# Altium schematic sheet Sheet1.SchDoc
size A; SheetNumber: 1; SheetTotal: 1
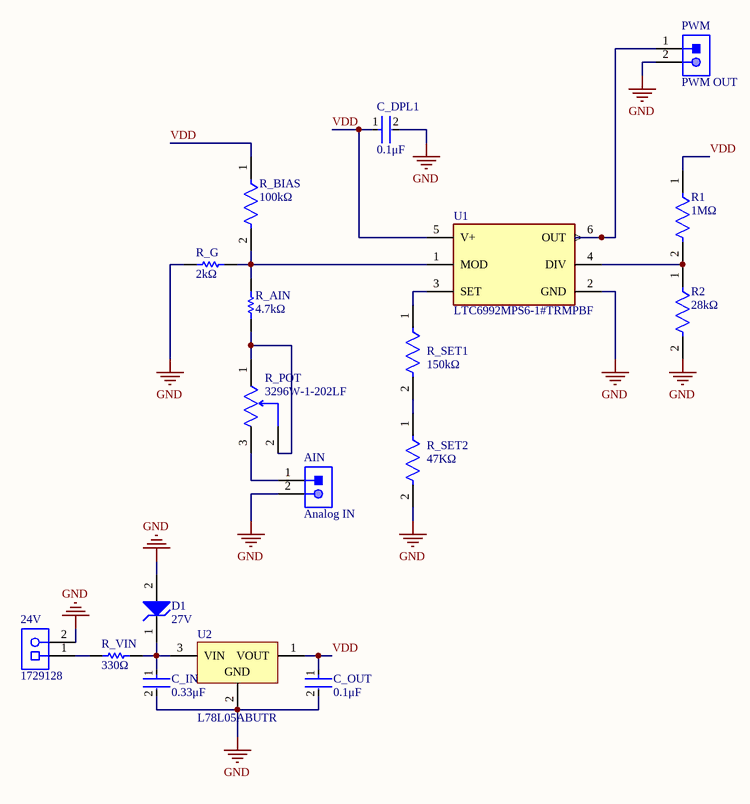
[diagram p0: Sheet1.SchDoc]

## Parts
24V  1729128  [PHOE-1729128-2_V]
AIN  Analog IN  [JST-S2B-XH-A(LF)(SN)_V]
C_DPL1  0.1μF  [FP-GCM21B-0_15-MFG]
C_IN  0.33μF  [FP-GCM219-0_15-MFG]
C_OUT  0.1μF  [FP-GCM21B-0_15-MFG]
D1  27V  [ONSC-POWERMITE-2-457-04_D_V]
PWM  PWM OUT  [JST-S2B-XH-A(LF)(SN)_V]
R1  1MΩ  [FP-RG2012-MFG]
R2  28kΩ  [FP-RG2012-MFG]
R_AIN  4.7kΩ  [RESC2013X60X40ML20T25]
R_BIAS  100kΩ  [FP-ERA6A-IPC_B]
R_G  2kΩ  [RESC2013X60X40ML20T25]
R_POT  3296W-1-202LF  [FP-3296W-MFG]
R_SET1  150kΩ  [FP-ERA6A-MFG]
R_SET2  47KΩ  [FP-ERA6A-MFG]
R_VIN  330Ω  [RESC2013X60X40LL20T25]
U1  LTC6992MPS6-1#TRMPBF  [FP-S6-6-05-08-1636-IPC_B]
U2  L78L05ABUTR  [SOT-89_N]

## Nets
GND: 24V.2 AIN.2 C_DPL1.2 C_IN.2 C_OUT.2 D1.2(A) PWM.2 R2.2 R_G.1 R_SET2.2 U1.2(GND) U2.2(GND)
VDD: C_DPL1.1 C_OUT.1 R1.1 R_BIAS.1 U1.5(V+) U2.1(VOUT)
Net24V_1: 24V.1 R_VIN.1
NetAIN_1: AIN.1 R_POT.3(CW)
NetC_IN_1: C_IN.1 D1.1(K) R_VIN.2 U2.3(VIN)
NetPWM_1: PWM.1 U1.6(OUT)
NetR1_2: R1.2 R2.1 U1.4(DIV)
NetR_AIN_1: R_AIN.1 R_POT.1(CCW) R_POT.2(WIPER)
NetR_AIN_2: R_AIN.2 R_BIAS.2 R_G.2 U1.1(MOD)
NetR_SET1_1: R_SET1.1 U1.3(SET)
NetR_SET1_2: R_SET1.2 R_SET2.1

## Library data of the parts
24V = CMP-2000-05815-1: PCB Terminal Block, 13.5 A, 400 V, 2-Pin THD, RoHS, Bulk; Manufacturer: Phoenix Contact; Package Version: 03/2015; No. of Rows: 1; Pitch: 5.08mm; No. of Positions: 2; Voltage Rating: 400V; Current Rating: 13500mA; Manufacturer URL: http://www.phoenixcontact.com/; Datasheet URL: https://datasheet.ciiva.com/16046/1729128-16046181.pdf; RoHS: TRUE; Package URL: https://www.phoenixcontact.com/online/portal/pi/pxc/product_detail_page/!ut/p/b1/3VdJjqNKFDxLH8AFycySyWY2ozFsEPOMMQaDOX1XedGL_1Vdm5YXJleknhSKeBkvI6EA8ncAo3AYoDhBQGco6KN7VURTdemj9us_IEKEZo_YHiPAEWEFmDGOHMORkqKYCORBZxgL7ZoaZYcbFFUZ3fqxSY6GOuxydWUuHqz1ynmMFygu583Bob0Ewr6Sd_l-5m-kAueHiB0jpRwZwe58wwtkpxtMYd_LmGcDRU02dRNEyWt6Y2ti5pSyJ_reIkzIulrqApdnbT11V5jnCKbYNCvhEM1MCpPByat_X379-iThf08CI5GfOPqfBeS3BRoBOdD55AKVv0iLwCMq-2BrzXWSGRH7pUGD9uwXQjiph3xL0DKQwdGa0JImiIOmBNOestqgwTHSSs2oOep-78apyXQBvNi8ZLaFjvjWvcaUEBu0MC6Wbe-d6mB0FAebo2lUWinqYaZs5DAYzV0RP9yitUjnGJ0iI9xhZkT42OCQNUJJhkgWINNQLP2JFP6OpMg3JCVg70jqHT0lvKOnhHf0lPuOnnLf0VPuWx6_dxwUIvwk5WMkT0kLL1mh61l2yZVSzG3pYV_bqo-mj6uMKwKwdnnW8Jh5RTOJzMOA5c-eJDaZQw4mTMPH02PvS_ZAqNVjVTo2WyYLkwH_KU1mmmG5kjRhDqPXLwwVHvVOjCM60-fpXvTDfMGW1PVFVS1r4e4yVDk4ZdNbkUHvqPqQSeian4UD39fNKmachqdJ1NJbyk8rXT9mXTvPk3oE5meulKGgiruPJek-4I9hTT6G8ZLOyRSm2RRVbThERQad5OS28hdt4YW4vG0stgYYzsWsK4_7y6DZMjJSCqri1kyiZR5vD7pwIrNR7QwPHTcLTI5qT7eRlpHrdGiupYlqQDJ7zy_CND8fWWBoLRXxk1RVcXiBQwbTD4Xi7KL-FuO94t9xaqweXzH; PartNumber: 1729128; Package Description: 2-Pin Through Hole Device, Body 8.1 x 10.16 mm, Pitch 5.08 mm; Datasheet Version: 12/2013; Mounting Technology: ThroughHole; Orientation: Horizontal; Package Reference: 1729128-2; Packing: Bulk
AIN PWM = CMP-1755-00005-1: Male Header, Pitch 2.5 mm, 1 x 2 Position, Height 6.1 mm, Tail Length 3.4 mm, -25 to 85 degC, RoHS, Bulk; Type (Capacitors): X7R; Voltage Rating (DC): 100 V; Tolerance: 10%; Capacitance: 1 nF; Case\Package: Radial; Min Operating Temperature: -55 degC; Mount: Through Hole; Package Quantity: 500; PackageReference: S2B-XH-A(LF)(SN); ComponentLink1Description: Manufacturer URL; Max Operating Temperature: 125 degC; ComponentLink2Description: Datasheet; RoHSCompliant: true; PackageDescription: Male Header, Pitch 2.5 mm, 1 x 2 Position, Height 6.1 mm, Tail Length 3.4 mm; REACH SVHC: No SVHC; Packaging: Bulk; Width: 3.81 mm; Length: 5.33 mm; Height: 2.54 mm; Pins: 2; Radiation Hardening: No; ComponentLink1URL: http://www.jst.com/home2.html; Lead Pitch: 2.54 mm; DatasheetVersion: May-16; Voltage Rating: 100 V; ComponentLink2URL: http://www.jst-mfg.com/product/pdf/eng/eXH.pdf
C_DPL1 C_OUT = CMP-2007-03364-2: Ceramic Capacitor for Automotive 100nF ±10% 100VDC X7R 0805 Embossed T/R; Voltage Rating: 100V; Termination: SMD/SMT; Tolerance: 10%; Case Code (Imperial): 0805; Length: 2mm; Max Operating Temperature: 125°C; Case/Package: 0805; Mount: Surface Mount; Packaging: Tape and Reel; Package Quantity: 1; Min Operating Temperature: -55°C; Case Code (Metric): 2012; Radiation Hardening: No; REACH SVHC: No SVHC; Dielectric: X7R; Depth: 1.25mm; Lead Free: Lead Free; Ratings: AEC-Q200; Height: 1.25mm; Voltage: 100V; Capacitance: 100nF; Voltage Rating (DC): 100V; Width: 0.049inch; Thickness: 0.055inch
C_IN = CMP-2007-00092-2: Ceramic Capacitor for Automotive 330nF  ±10% 50VDC X7R 0805 Paper T/R; Voltage Rating: 50V; Width: 0.049inch; Depth: 1.25mm; Tolerance: 10%; Height: 0.85mm; Package Quantity: 4000; Packaging: Tape and Reel; Termination: SMD/SMT; Radiation Hardening: No; Mount: Surface Mount; Max Operating Temperature: 125°C; Dielectric: X7R; Capacitance: 330nF; Thickness: 0.037inch; Min Operating Temperature: -55°C; Lead Free: Lead Free; Ratings: AEC-Q200; Case Code (Metric): 2012; Voltage Rating (DC): 50V; Case Code (Imperial): 0805; Length: 2mm; Case/Package: 0805
D1 = CMP-1060-00053-1: 3.2 W Plastic Surface Mount, 2-Pin POWERMITE, Pb-Free, Tape and Reel; Manufacturer: On Semiconductor; PartNumber: 1PMT5935BT1G; VZ Typ (V): 27; PackageReference: POWERMITE-2-457-04; PackageDescription: 2-Pin POWERMITE, Body 1.965 x 1.9 mm; ComponentLink1URL: http://www.onsemi.com/; DatasheetVersion: Rev. 4; ComponentLink2URL: http://www.onsemi.com/pub_link/Collateral/1PMT5920B-D.PDF; ComponentLink2Description: Datasheet; ComponentLink3URL: http://www.onsemi.com/pub_link/Collateral/457-04.PDF; ComponentLink3Description: Package Specification; Packing: Tape and Reel; RoHS: Pb-Free; PackageVersion: Rev. F, 05/2013; Mounting Technology: Surface Mount; ComponentLink1Description: Manufacturer URL
R1 = CMP-2001-02713-2: Automotive Metal Thin Film Chip Resistor, 0805, 1MΩ, 0.1%, 25ppm/°C, 0.125W, 150V; Max Power Dissipation: 125mW; Power Rating: 100mW; Resistance: 1MR; Voltage Rating: 100V; Voltage Rating (DC): 150V; Lead Free: Lead Free; Length: 2mm; Number of Terminations: 2; RoHS Compliant: Yes; Case/Package: 0805; Height: 0.4mm; Case Code (Metric): 2012; Temperature Coefficient: 25ppm/°C; Features: Automotive AEC-Q200; Package Quantity: 5000; Width: 1.25mm; Termination: SMD/SMT; Case Code (Imperial): 0805; Tolerance: 0.1%; Max Operating Temperature: 155°C; Packaging: Tape and Reel; Min Operating Temperature: -55°C; Series: RG
R2 = CMP-2001-02887-2: Automotive Metal Thin Film Chip Resistor, 0805, 280kΩ, 0.1%, 25ppm/°C, 0.125W, 150V; Resistance: 280kR; Power Rating: 125mW; Voltage Rating: 150V; Max Operating Temperature: 155°C; Width: 0.049inch; Case Code (Metric): 2012; Min Operating Temperature: -55°C; Features: Automotive AEC-Q200; RoHS Compliant: Yes; Termination: SMD/SMT; Temperature Coefficient: 25ppm/°C; Number of Terminations: 2; Voltage Rating (DC): 150V; Case/Package: 0805; Weight: 0.000194oz; Package Quantity: 1; Resistor Type: Thin Film; Packaging: Tape and Reel; Height: 0.02inch; Series: RG; Max Power Dissipation: 125mW; Length: 0.079inch; Case Code (Imperial): 0805; Lead Free: Lead Free; Tolerance: 0.1%
R_AIN = CMP-2001-00644-1: Part Number: ERA6AEB472V; Manufacturer: Panasonic
R_BIAS = CMP-2001-00583-2: RES 100K OHM 0.1% 1/8W 0805; Max Power Dissipation: 125mW; Voltage Rating: 100V; Resistance: 100kR; Temperature Coefficient: 25ppm/°C; Resistance Tolerance: 0.1%; Resistor Type: Thin Film; Mount: Surface Mount; Package Quantity: 1; RoHS Compliant: Yes; Features: Automotive AEC-Q200; Termination: Solder; Contact Plating: Tin; Number of Pins: 2; Construction: Rectangular; Size Code: 0805; Case/Package: 0805; Military Standard: Not; Voltage Rating (DC): 100V; Max Operating Temperature: 155°C; REACH SVHC: No SVHC; Series: ERA-6A; Case Code (Metric): 2012; Number of Terminations: 2; Tolerance: 0.1%; Width: 1.25mm; Depth: 1.25mm; Lead Free: Lead Free; Radiation Hardening: No; Length: 2mm; Technology: METAL FILM; Power Rating: 125mW; Min Operating Temperature: -55°C; Height: 0.5mm; Case Code (Imperial): 0805; Packaging: Tape and Reel
R_G = CMP-2001-00609-1: Part Number: ERA6AEB202V; Manufacturer: Panasonic
R_POT = CMP-2000-05582-2: TRIMMER 2K OHM 0.5W PC PIN TOP; Resistance Tolerance: 10%; Max Power Dissipation: 500mW; Number of Turns: 25; Temperature Coefficient: 100ppm/°C; Resistance: 2kR; Taper: Linear; Width: 9.53mm; Radiation Hardening: No; Length: 9.53mm; Packaging: Rail/Tube; Lead Free: Lead Free; Mount: Panel; Min Operating Temperature: -55°C; Power Rating: 500mW; RoHS Compliant: Yes; REACH SVHC: No SVHC; Color: Blue; Package Quantity: 50; Contact Plating: Tin; Weight: 0.03oz; Technology: CERMET; Max Operating Temperature: 125°C; Tolerance: 10%; Termination: Pin; Resistor Type: Cermet; Military Standard: Not; Height: 0.395inch; Series: 3296; Depth: 4.83mm
R_SET1 = CMP-2001-00599-2: RES 150K OHM 0.1% 1/8W 0805; Voltage Rating: 100V; Power Rating: 125mW; Resistance: 150kR; Temperature Coefficient: 25ppm/°C; Termination: SMD/SMT; Number of Terminations: 2; Case Code (Metric): 2012; Number of Pins: 2; Radiation Hardening: No; Technology: METAL FILM; Construction: Rectangular; Contact Plating: Tin; Width: 1.25mm; Resistor Type: Thin Film; Length: 2mm; Max Power Dissipation: 125mW; Mount: Surface Mount; REACH SVHC: No SVHC; Packaging: Tape and Reel; Min Operating Temperature: -55°C; Lead Free: Lead Free; Resistance Tolerance: 0.1%; Depth: 1.25mm; RoHS Compliant: Yes; Military Standard: Not; Max Operating Temperature: 155°C; Package Quantity: 5000; Series: ERA-6A; Height: 0.5mm; Case Code (Imperial): 0805; Tolerance: 0.1%; Voltage Rating (DC): 100V; Case/Package: 0805
R_SET2 = CMP-2001-00645-2: NexarPartId: 1264112; Voltage Rating (DC): 100V; Max Power Dissipation: 125mW; Temperature Coefficient: 25ppm/°C; Tolerance: 0.1%; Case Code (Metric): 2012; Packaging: Cut Tape; Number of Terminations: 2; Max Operating Temperature: 155°C; Height: 500µm; Number of Pins: 2; Min Operating Temperature: -55°C; Resistance: 47kΩ; RoHS: Compliant; Features: Automotive AEC-Q200; Schedule B: 8533210045, 8533210045; Contact Plating: Tin; Case Code (Imperial): 0805; Lead Free: Lead Free; Lifecycle Status: Production; Termination: SMD/SMT; Weight: 5.499807mg; REACH SVHC: No SVHC; Voltage Rating: 100V; Mount: Surface Mount; Radiation Hardening: No; Military Standard: Not; Power Rating: 125mW; Length: 2mm; Depth: 1.25mm; Width: 1.25mm; Composition: Metal Film, Thin Film; Case/Package: 0805
R_VIN = CMP-2001-00628-1: Manufacturer: Panasonic; Part Number: ERA6AEB331V
U1 = CMP-09075-000003-1: IC OSC SILICON PROG TSOT23-6; Operating Supply Current: 365uA; Frequency: 3.81Hz; Package Quantity: 500; Mount: Surface Mount; Max Operating Temperature: 125°C; Case/Package: SOT-23-6; Min Operating Temperature: -55°C; RoHS Compliant: Yes; Number of Pins: 6; Series: TimerBlox®; Packaging: Tape and Reel
U2 = CMP-0244-00406-1: Positive Voltage Regulator, 5V, 4-Pin SOT-89, Tape and Reel; PackageVersion: 2011; DatasheetVersion: 1/02/2011; PackageDescription: 3-Pin SOT-89 Package 1.5 mm Pitch, 4.1 mm Lead Span; PackageReference: SOT-89; ComponentLink2Description: Datasheet; ComponentLink1URL: http://www.st.com; ComponentLink1Description: Manufacturer URL; ComponentLink2URL: http://www.st.com/internet/com/TECHNICAL_RESOURCES/TECHNICAL_LITERATURE/DATASHEET/CD00000446.pdf